# Altium project Booost.PrjPcb
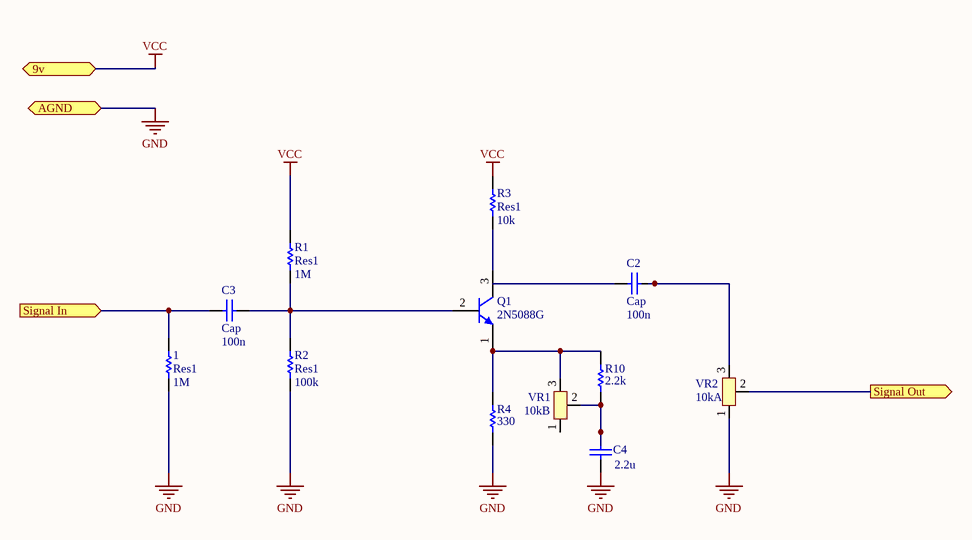
[diagram p0: TrebleBoost.SchDoc]
4 sheets, 37 parts. Net scope: flat (ports and power ports of the same name join across sheets).
Sheets:
  TrebleBoost.SchDoc
  FullBoost.SchDoc
  PSU.SchDoc
  RelayBypass.SchDoc

## Sheet TrebleBoost.SchDoc: Treble Boost
size A4; Author: Jeremiah Lilland; CompanyName: Pinebox Effects; DrawnBy: Jeremiah Lilland; Revision: 1.0; SheetNumber: 2; SheetTotal: 5; ProjectName: Booost

### Parts
1  Res1  value 1M  [AXIAL-0.3]
C2  Cap  value 100n  [RAD-0.3]
C3  Cap  value 100n  [RAD-0.3]
C4  value 2.2u  [RAD-0.3]  (hidden comment: Cap)
Q1  2N5088G  [ONSC-TO-92-3-29-11]
R1  Res1  value 1M  [AXIAL-0.3]
R2  Res1  value 100k  [AXIAL-0.3]
R3  Res1  value 10k  [AXIAL-0.3]
R4  value 330  [AXIAL-0.3]  (hidden comment: Res1)
R10  value 2.2k  [AXIAL-0.3]  (hidden comment: Res1)
VR1  value 10kB  [Pot-16mm]  (hidden comment: Pot-16mm)
VR2  value 10kA  [Pot-16mm]  (hidden comment: Pot-16mm)

### Ports
9v (bidir), AGND (bidir), Signal In (in), Signal Out (out)

### Nets
GND: 1.1 C4.1 R2.1 R4.1 VR2.1 ; port AGND
Vcc: R1.2 R3.2 ; port 9v
Net1_2: 1.2 C3.1 ; port Signal In
NetC2_1: C2.1 VR2.3
NetC3_2: C3.2 Q1.2(B) R1.1 R2.2
NetC4_2: C4.2 R10.1 VR1.2
NetQ1_1: Q1.1(E) R4.2 R10.2 VR1.3
NetQ1_3: Q1.3(C) R3.1
NetVR2_2: VR2.2 ; port Signal Out

Not connected (* = marked no-connect by the designer): C2 2; VR1 1

### Notes on the sheet
- Sheet Title:
- Project Title:
- Date:
- Revision:
- Sheet
- of
- File:

### Library data of the parts
1 R1-R4 R10 = Res1: Resistor; LatestRevisionDate: 17-Jul-2002; LatestRevisionNote: Re-released for DXP Platform.; PackageReference: AXIAL-0.3; Publisher: Altium Limited; PackageDescription: Axial Device, Thru-Hole; 2 Leads; 0.3 in Pin Spacing
  1 R1 R2 R4 R10: Published: 8-Jun-2000
C2-C4 = Cap: Capacitor; Published: 8-Jun-2000; LatestRevisionDate: 17-Jul-2002; LatestRevisionNote: Re-released for DXP Platform.; PackageReference: RAD-0.3; Publisher: Altium Limited; PackageDescription: Radial Cap, Thru-Hole; 2 Leads; 0.3 in Pin Spacing
Q1 = 2N5088G: Amplifier Transistor, NPN Silicon, 3-Pin TO-92, Pb-Free, Bulk Box; Manufacturer: On Semiconductor; fT Min (MHz): 50; IC Continuous (A): 0.05; DatasheetVersion: Rev. 4; PackageVersion: Rev. AM; PackageReference: TO-92-3-29-11_AM_SL; PackageDescription: 3-Pin Transistor Outline, Body 4.825 x 3.685 mm, Pitch 1.27 mm; Packing: Bulk Box; Polarity: NPN; RoHS: TRUE; Mounting Technology: Through Hole; PartNumber: 2N5088G; ComponentLink1Description: Manufacturer URL; ComponentLink1URL: http://www.onsemi.com/; ComponentLink2Description: Datasheet; ComponentLink2URL: http://www.onsemi.com/pub_link/Collateral/2N5088-D.PDF; ComponentLink3Description: Package Specification; ComponentLink3URL: http://www.onsemi.cn/pub_link/Collateral/2N6426-D.PDF; Supplier 1: Newark; Supplier Part Number 1: 42K3133; Supplier 2: Mouser; Supplier Part Number 2: 863-2N5088G
VR1 VR2 = Pot-16mm: Potentiometer 16mm

## Sheet FullBoost.SchDoc
size A4; Author: Jeremiah Lilland; CompanyName: Pinebox Effects; DrawnBy: Jeremiah Lilland; Revision: 1.0
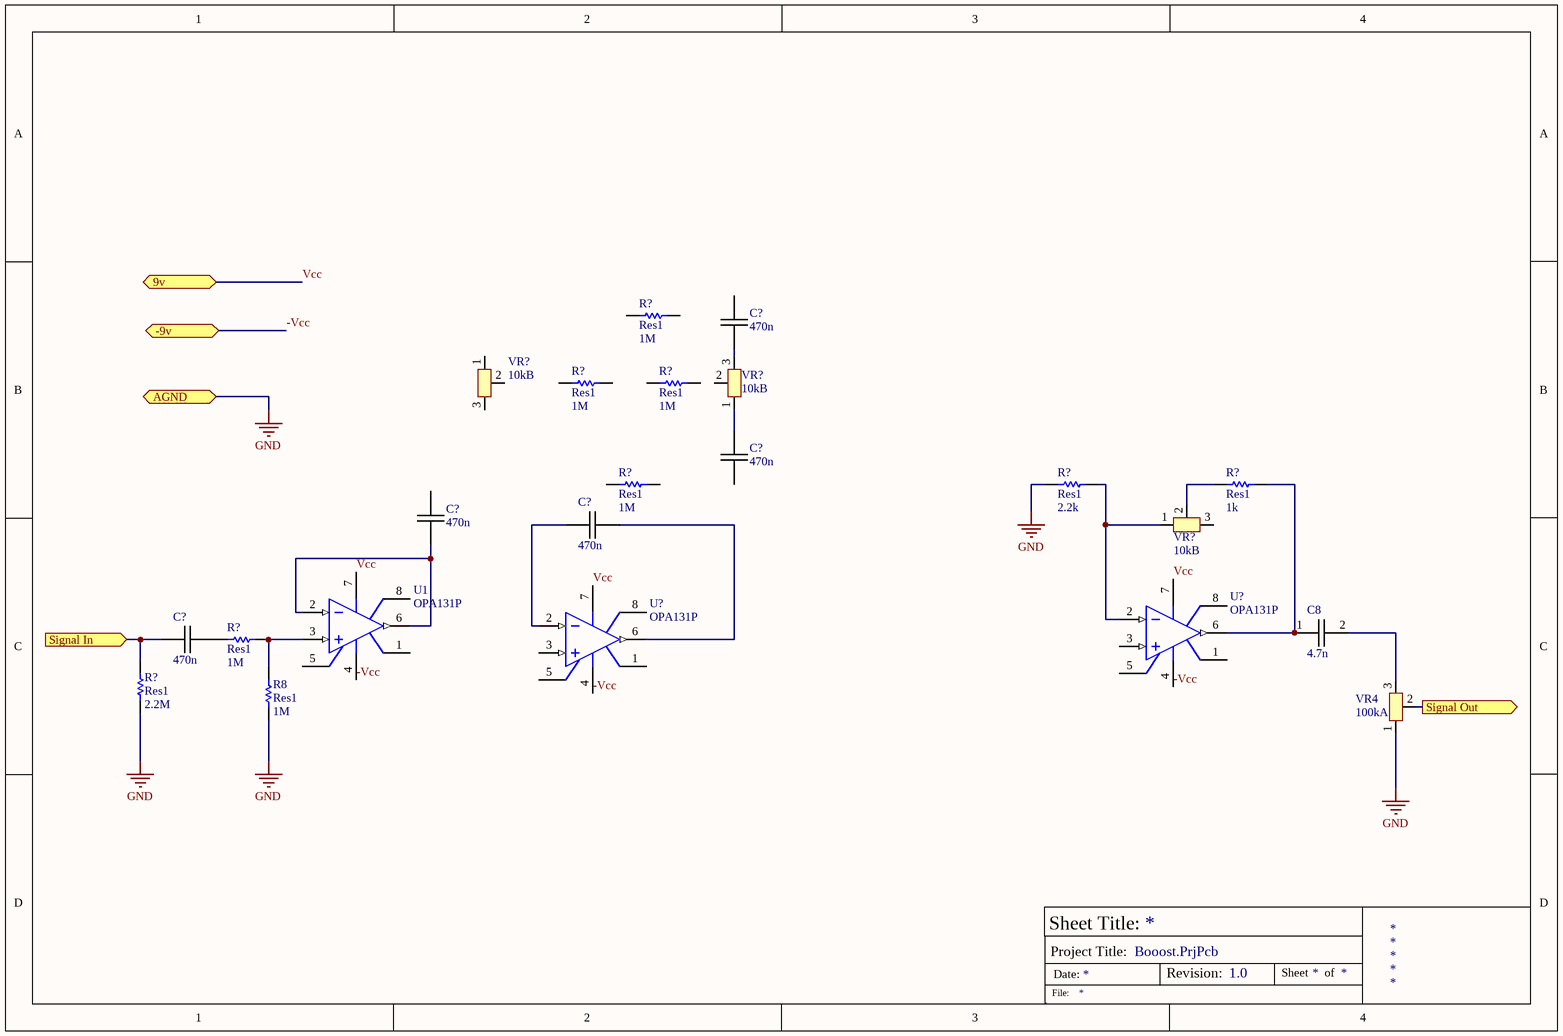
[diagram p1: FullBoost.SchDoc]

### Parts
(Parts that share a designator on the sheet are numbered #1, #2 ... from top to bottom, then left to right.)
C8  value 4.7n  [Capacitor]  (hidden comment: Wima Capacitor)
C?#1  value 470n  [Capacitor]  (hidden comment: Wima Capacitor)
C?#2  value 470n  [Capacitor]  (hidden comment: Wima Capacitor)
C?#3  value 470n  [Capacitor]  (hidden comment: Wima Capacitor)
C?#4  value 470n  [Capacitor]  (hidden comment: Wima Capacitor)
C?#5  value 470n  [Capacitor]  (hidden comment: Wima Capacitor)
R8  Res1  value 1M  [AXIAL-0.3]
R?#1  Res1  value 1M  [AXIAL-0.3]
R?#2  Res1  value 1M  [AXIAL-0.3]
R?#3  Res1  value 1M  [AXIAL-0.3]
R?#4  Res1  value 1M  [AXIAL-0.3]
R?#5  Res1  value 2.2k  [AXIAL-0.3]
R?#6  Res1  value 1k  [AXIAL-0.3]
R?#7  Res1  value 1M  [AXIAL-0.3]
R?#8  Res1  value 2.2M  [AXIAL-0.3]
U1  OPA131P  [006E]
U?#1  OPA131P  [006E]
U?#2  OPA131P  [006E]
VR4  value 100kA  [Pot-16mm]  (hidden comment: Pot-16mm)
VR?#1  value 10kB  [Pot-16mm]  (hidden comment: Pot-16mm)
VR?#2  value 10kB  [Pot-16mm]  (hidden comment: Pot-16mm)
VR?#3  value 10kB  [Pot-16mm]  (hidden comment: Pot-16mm)

### Ports
9v (bidir), -9v (bidir), AGND (bidir), Signal In (in), Signal Out (out)

### Nets
GND: R8.1 R?#5.2 R?#8.1 VR4.1 ; port AGND
Vcc: U1.7(V+) U?#1.7(V+) U?#2.7(V+) ; port 9v
-Vcc: U1.4(V-) U?#1.4(V-) U?#2.4(V-) ; port -9v
Net1_2: C?#5.2 R?#8.2 ; port Signal In
NetC8_1: C8.1 R?#6.1 U?#1.6(OUT)
NetC8_2: C8.2 VR4.3
NetC?#1_2: C?#1.2 VR?#2.3
NetC?#2_1: C?#2.1 VR?#2.1
NetC?#3_1: C?#3.1 U1.2(IN-) U1.6(OUT)
NetC?#4_1: C?#4.1 U?#2.6(OUT)
NetC?#4_2: C?#4.2 U?#2.2(IN-)
NetC?#5_1: C?#5.1 R?#7.2
NetR8_2: R8.2 R?#7.1 U1.3(IN+)
NetR?#5_1: R?#5.1 U?#1.2(IN-) VR?#3.1
NetR?#6_2: R?#6.2 VR?#3.2
NetVR2_2: VR4.2 ; port Signal Out

Not connected (* = marked no-connect by the designer): C?#1 1; C?#2 2; C?#3 2; R?#1 1 2; R?#2 1 2; R?#3 1 2; R?#4 1 2; U1 1(OS_TRIM) 5(OS_TRIM) 8(NC); U?#1 1(OS_TRIM) 3(IN+) 5(OS_TRIM) 8(NC); U?#2 1(OS_TRIM) 3(IN+) 5(OS_TRIM) 8(NC); VR?#1 1 2 3; VR?#2 2; VR?#3 3

### Notes on the sheet
- Sheet Title:
- Project Title:
- Date:
- Revision:
- Sheet
- of
- File:

### Library data of the parts
R8 R?#1-R?#8 = Res1: Resistor; Published: 8-Jun-2000; LatestRevisionDate: 17-Jul-2002; LatestRevisionNote: Re-released for DXP Platform.; PackageReference: AXIAL-0.3; Publisher: Altium Limited; PackageDescription: Axial Device, Thru-Hole; 2 Leads; 0.3 in Pin Spacing
U1 U?#1 U?#2 = OPA131P: General Purpose FET-Input Operational Amplifiers; Note: Pin 8 is No internal Connection (NC) pin.; Published: 8-Jun-2000; LatestRevisionDate: 06-Jun-2005; LatestRevisionNote: Stylized 3D Model Added.; DatasheetVersion: Jan-1996; PackageVersion: revE; PackageReference: 006E; Publisher: Altium Limited; PackageDescription: DIP; 8 Leads; Row Spacing 7.62 mm; Pitch 2.54 mm; ComponentLink1Description: Manufacturer Link; ComponentLink1URL: http://www.ti.com/; ComponentLink2Description: Datasheet; ComponentLink2URL: http://www-s.ti.com/sc/ds/OPA131.pdf
VR4 VR?#1-VR?#3 = Pot-16mm: Potentiometer 16mm

## Sheet PSU.SchDoc
size A4; Author: Jeremiah Lilland; CompanyName: Pinebox Effects; DrawnBy: Jeremiah Lilland; Revision: 1.0
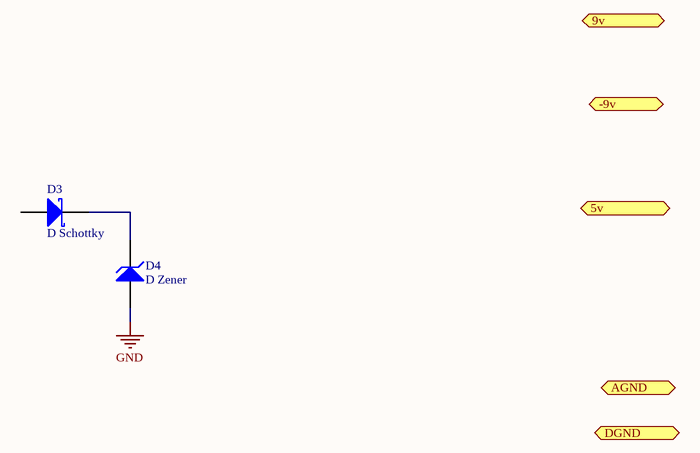
[diagram p2: PSU.SchDoc]

### Parts
D3  D Schottky  [SMB]
D4  D Zener  [DIODE-0.7]

### Ports
5v, 9v (bidir), -9v (bidir), AGND, DGND (bidir)

### Nets
GND: D4.1(A) ; port AGND
NetD3_2: D3.2(K) D4.2(K)

Not connected (* = marked no-connect by the designer): D3 1(A)

### Notes on the sheet
- Sheet Title:
- Project Title:
- Date:
- Revision:
- Sheet
- of
- File:

### Library data of the parts
D3 = D Schottky: Schottky Diode; Published: 8-Jun-2000; LatestRevisionDate: 17-Jul-2002; LatestRevisionNote: Re-released for DXP Platform.; PackageReference: SMB; Publisher: Altium Limited; PackageDescription: DO-214-AA/SMB; 2 C-Bend Leads; Body 5.3 x 3.6 mm, inc. leads (LxW); Code_JEDEC: DO-214-AA
D4 = D Zener: Zener Diode; Published: 8-Jun-2000; LatestRevisionDate: 17-Jul-2002; LatestRevisionNote: Re-released for DXP Platform.; PackageReference: DIODE-0.7; Publisher: Altium Limited; PackageDescription: Diode, Thru-Hole; 2 Leads; 0.7 in Pin Spacing

## Sheet RelayBypass.SchDoc
size A4; Author: Jeremiah Lilland; CompanyName: Pinebox Effects; DrawnBy: Jeremiah Lilland; Revision: 1.0
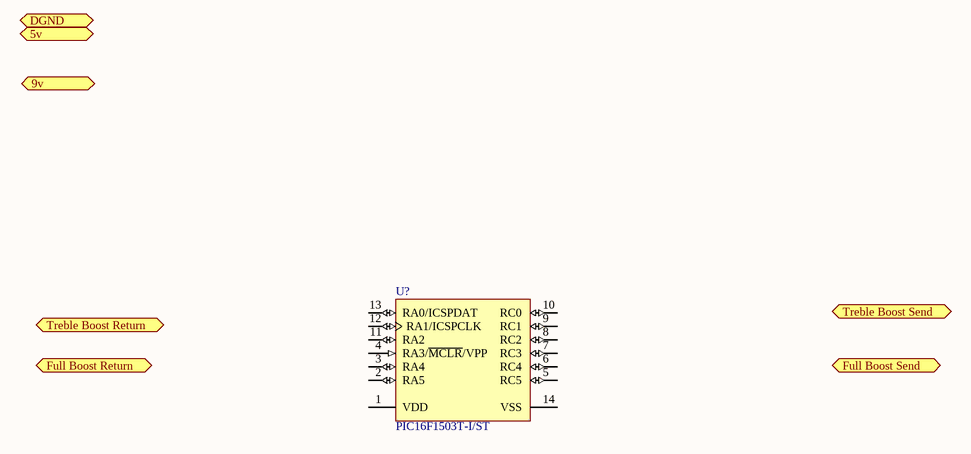
[diagram p3: RelayBypass.SchDoc]

### Parts
(Parts that share a designator on the sheet are numbered #1, #2 ... from top to bottom, then left to right.)
U?#3  PIC16F1503T-I/ST  [MCHP-TSSOP-ST14_N]

### Ports
5v, 9v (bidir), DGND, Full Boost Return (in), Full Boost Send (out), Treble Boost Return (in), Treble Boost Send (out)

### Nets

Not connected (* = marked no-connect by the designer): U?#3 1(VDD) 2(RA5) 3(RA4) 4(RA3/~{MCLR}/VPP) 5(RC5) 6(RC4) 7(RC3) 8(RC2) 9(RC1) 10(RC0) 11(RA2) 12(RA1/ICSPCLK) 13(RA0/ICSPDAT) 14(VSS)

### Notes on the sheet
- Sheet Title:
- Project Title:
- Date:
- Revision:
- Sheet
- of
- File:

### Library data of the parts
U?#3 = PIC16F1503T-I/ST: Flash, 8-Bit Microcontroller, 20 MHz, 11 I/O, -40 to 85 degC, 14-pin TSSOP (ST14), Tape and Reel; Manufacturer: Microchip; # of A/D Channels: 8; Digital Communication: 1 -MSSP(SPI/I2C); I/O Pins: 11; Internal Oscillator: 16 MHz, 31 kHz; Max. CPU Speed MHz: 20; Operation Voltage Range: 2.3V - 5.5V; Packing: T/R; Program Memory KBytes: 3.5; Program Memory KWords: 2; RAM: 128; Timers: 2 - 8-bit, 1 - 16-bit; DatasheetVersion: Rev. A; PackageVersion: C04-087C, 12/2012; PackageReference: TSSOP-ST14; PackageDescription: 14-Lead Plastic Thin Shrink Small Outline, 5 x 4.4 mm Body, 0.65 mm Pitch; Supplier 1: Digi-Key; Supplier Part Number 1: PIC16F1503T-I/ST-ND; Supplier 2: Newark; Supplier Part Number 2: 55T3638; Supplier 3: Mouser; Supplier Part Number 3: 579-PIC16F1503T-I/ST; Memory Type: Flash; RoHS: TRUE; Mounting Technology: Surface Mount; PartNumber: PIC16F1503T-I/ST; ComponentLink1Description: Datasheet; ComponentLink1URL: http://ww1.microchip.com/downloads/en/DeviceDoc/41607A.pdf; ComponentLink2Description: Package Specification; ComponentLink2URL: http://www.microchip.com/stellent/groups/techpub_sg/documents/packagingspec/en012702.pdf; ComponentLink3Description: URL Link1; ComponentLink3URL: Product URL:http://www.microchip.com/datasheet/PIC16F1503

## Nets that join several sheets
GND: TrebleBoost (5 pins), FullBoost (R8.1 R?#5.2 R?#8.1 VR4.1), PSU (D4.1)
Vcc: TrebleBoost (R1.2 R3.2), FullBoost (U1.7 U?#1.7 U?#2.7)
Net1_2: TrebleBoost (1.2 C3.1), FullBoost (C?#5.2 R?#8.2)
NetVR2_2: TrebleBoost (VR2.2), FullBoost (VR4.2)